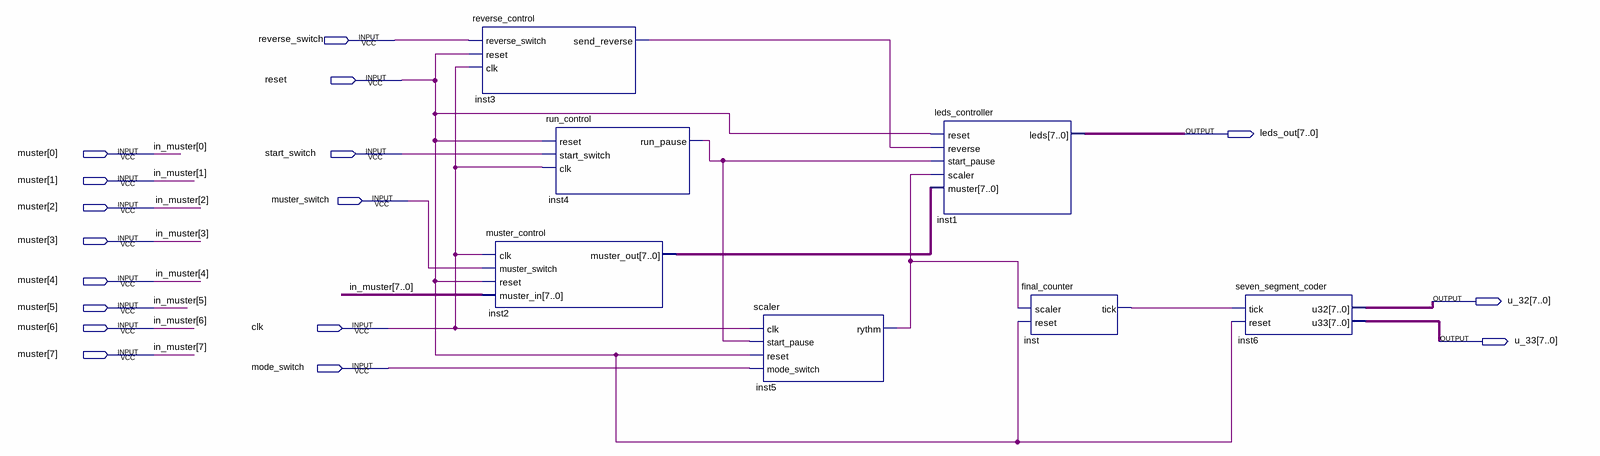
[diagram p0: schematic sheet]
// Quartus schematic lauflicht.bdf as structural Verilog: 7 symbols, 17 pins
module lauflicht (
  input  reverse_switch,
  input  reset,
  input  [7:0] muster,
  input  start_switch,
  input  muster_switch,
  input  clk,
  input  mode_switch,
  output [7:0] leds_out,
  output [7:0] u_32,
  output [7:0] u_33
);

  wire inst3_send_reverse, inst4_run_pause, inst5_rythm, inst_tick;
  wire [7:0] inst2_muster_out;

  reverse_control inst3 (.reverse_switch(reverse_switch), .reset(reset), .clk(clk), .send_reverse(inst3_send_reverse));
  muster_control inst2 (
    .clk(clk), .muster_switch(muster_switch), .reset(reset), .muster_in(muster), .muster_out(inst2_muster_out));
  run_control inst4 (.reset(reset), .start_switch(start_switch), .clk(clk), .run_pause(inst4_run_pause));
  scaler inst5 (
    .clk(clk), .start_pause(inst4_run_pause), .reset(reset), .mode_switch(mode_switch), .rythm(inst5_rythm));
  leds_controller inst1 (
    .reset(reset), .reverse(inst3_send_reverse), .start_pause(inst4_run_pause), .scaler(inst5_rythm),
    .muster(inst2_muster_out), .leds(leds_out));
  final_counter inst (.scaler(inst5_rythm), .reset(reset), .tick(inst_tick));
  seven_segment_coder inst6 (.tick(inst_tick), .reset(reset), .u32(u_32), .u33(u_33));

  // Other names for the same wires on the sheet: in_muster[7:0] = muster
endmodule
